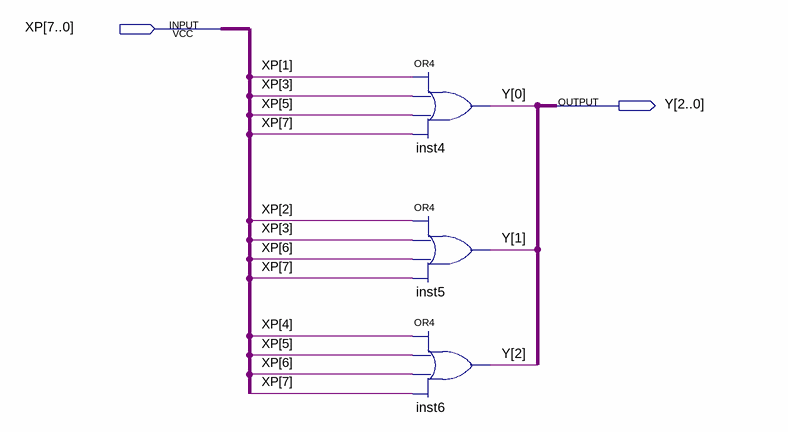
[diagram p0: schematic sheet]
// Quartus schematic CD_8_3.bdf as structural Verilog: 3 symbols, 2 pins
module CD_8_3 (
  input  [7:0] XP,
  output [2:0] Y
);

  or inst4 (Y[0], XP[1], XP[3], XP[5], XP[7]);
  or inst5 (Y[1], XP[2], XP[3], XP[6], XP[7]);
  or inst6 (Y[2], XP[4], XP[5], XP[6], XP[7]);
endmodule
